# EasyEDA schematic SCH_TWINKLING_CHRISMATIS_LIGHT_2023-04-27.json

## Sheets
1 MAIN_SCHEMATIC_TWINKLING_CHRISTMAS_LIGHT: TITLE: LED twinkling controller microcontroller schematic; REV: 1.0; Date: 2023-02-24; Sheet: 1/1; Drawn By: misha-dig; Company: TWINKLING_CHRISTMAS_LIGHT
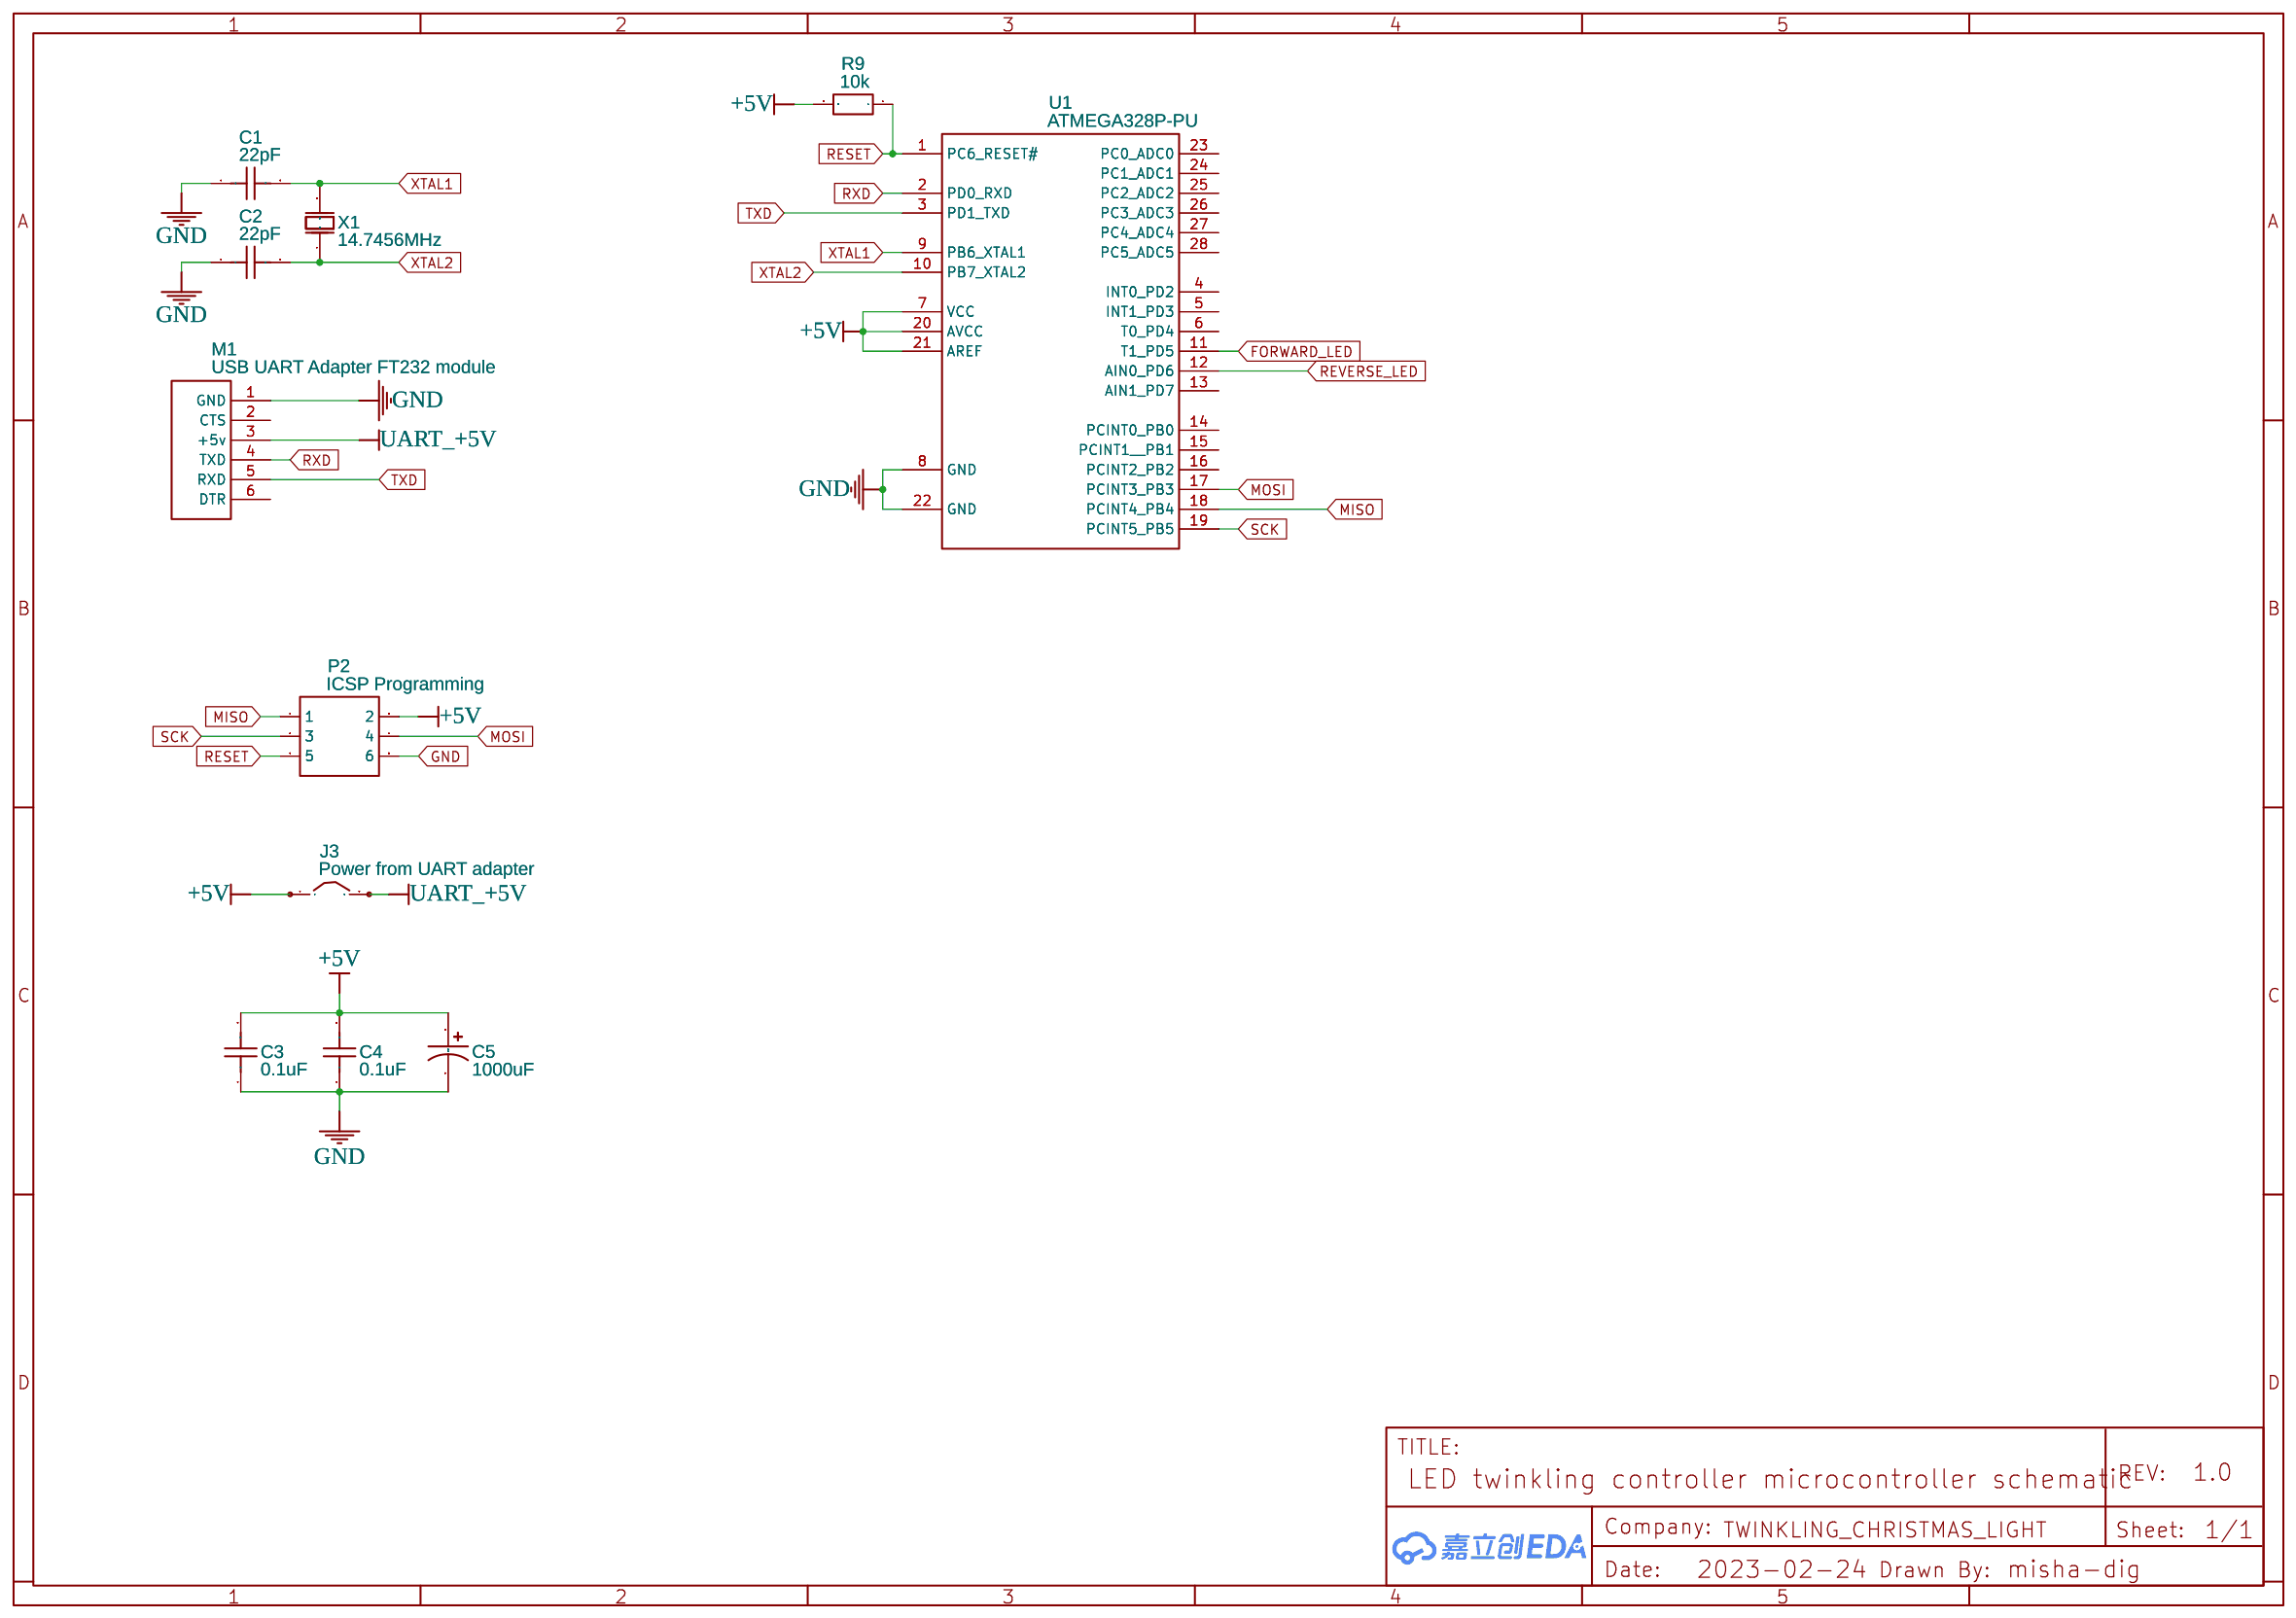
[diagram p0: MAIN_SCHEMATIC_TWINKLING_CHRISTMAS_LIGHT]
2 H-BRIDGE_SCHEMATIC_TWINKLING_CHRISTMAS_LIGHT: TITLE: LED twinkling controller H-Bridge schematic; Date: 2023-04-17
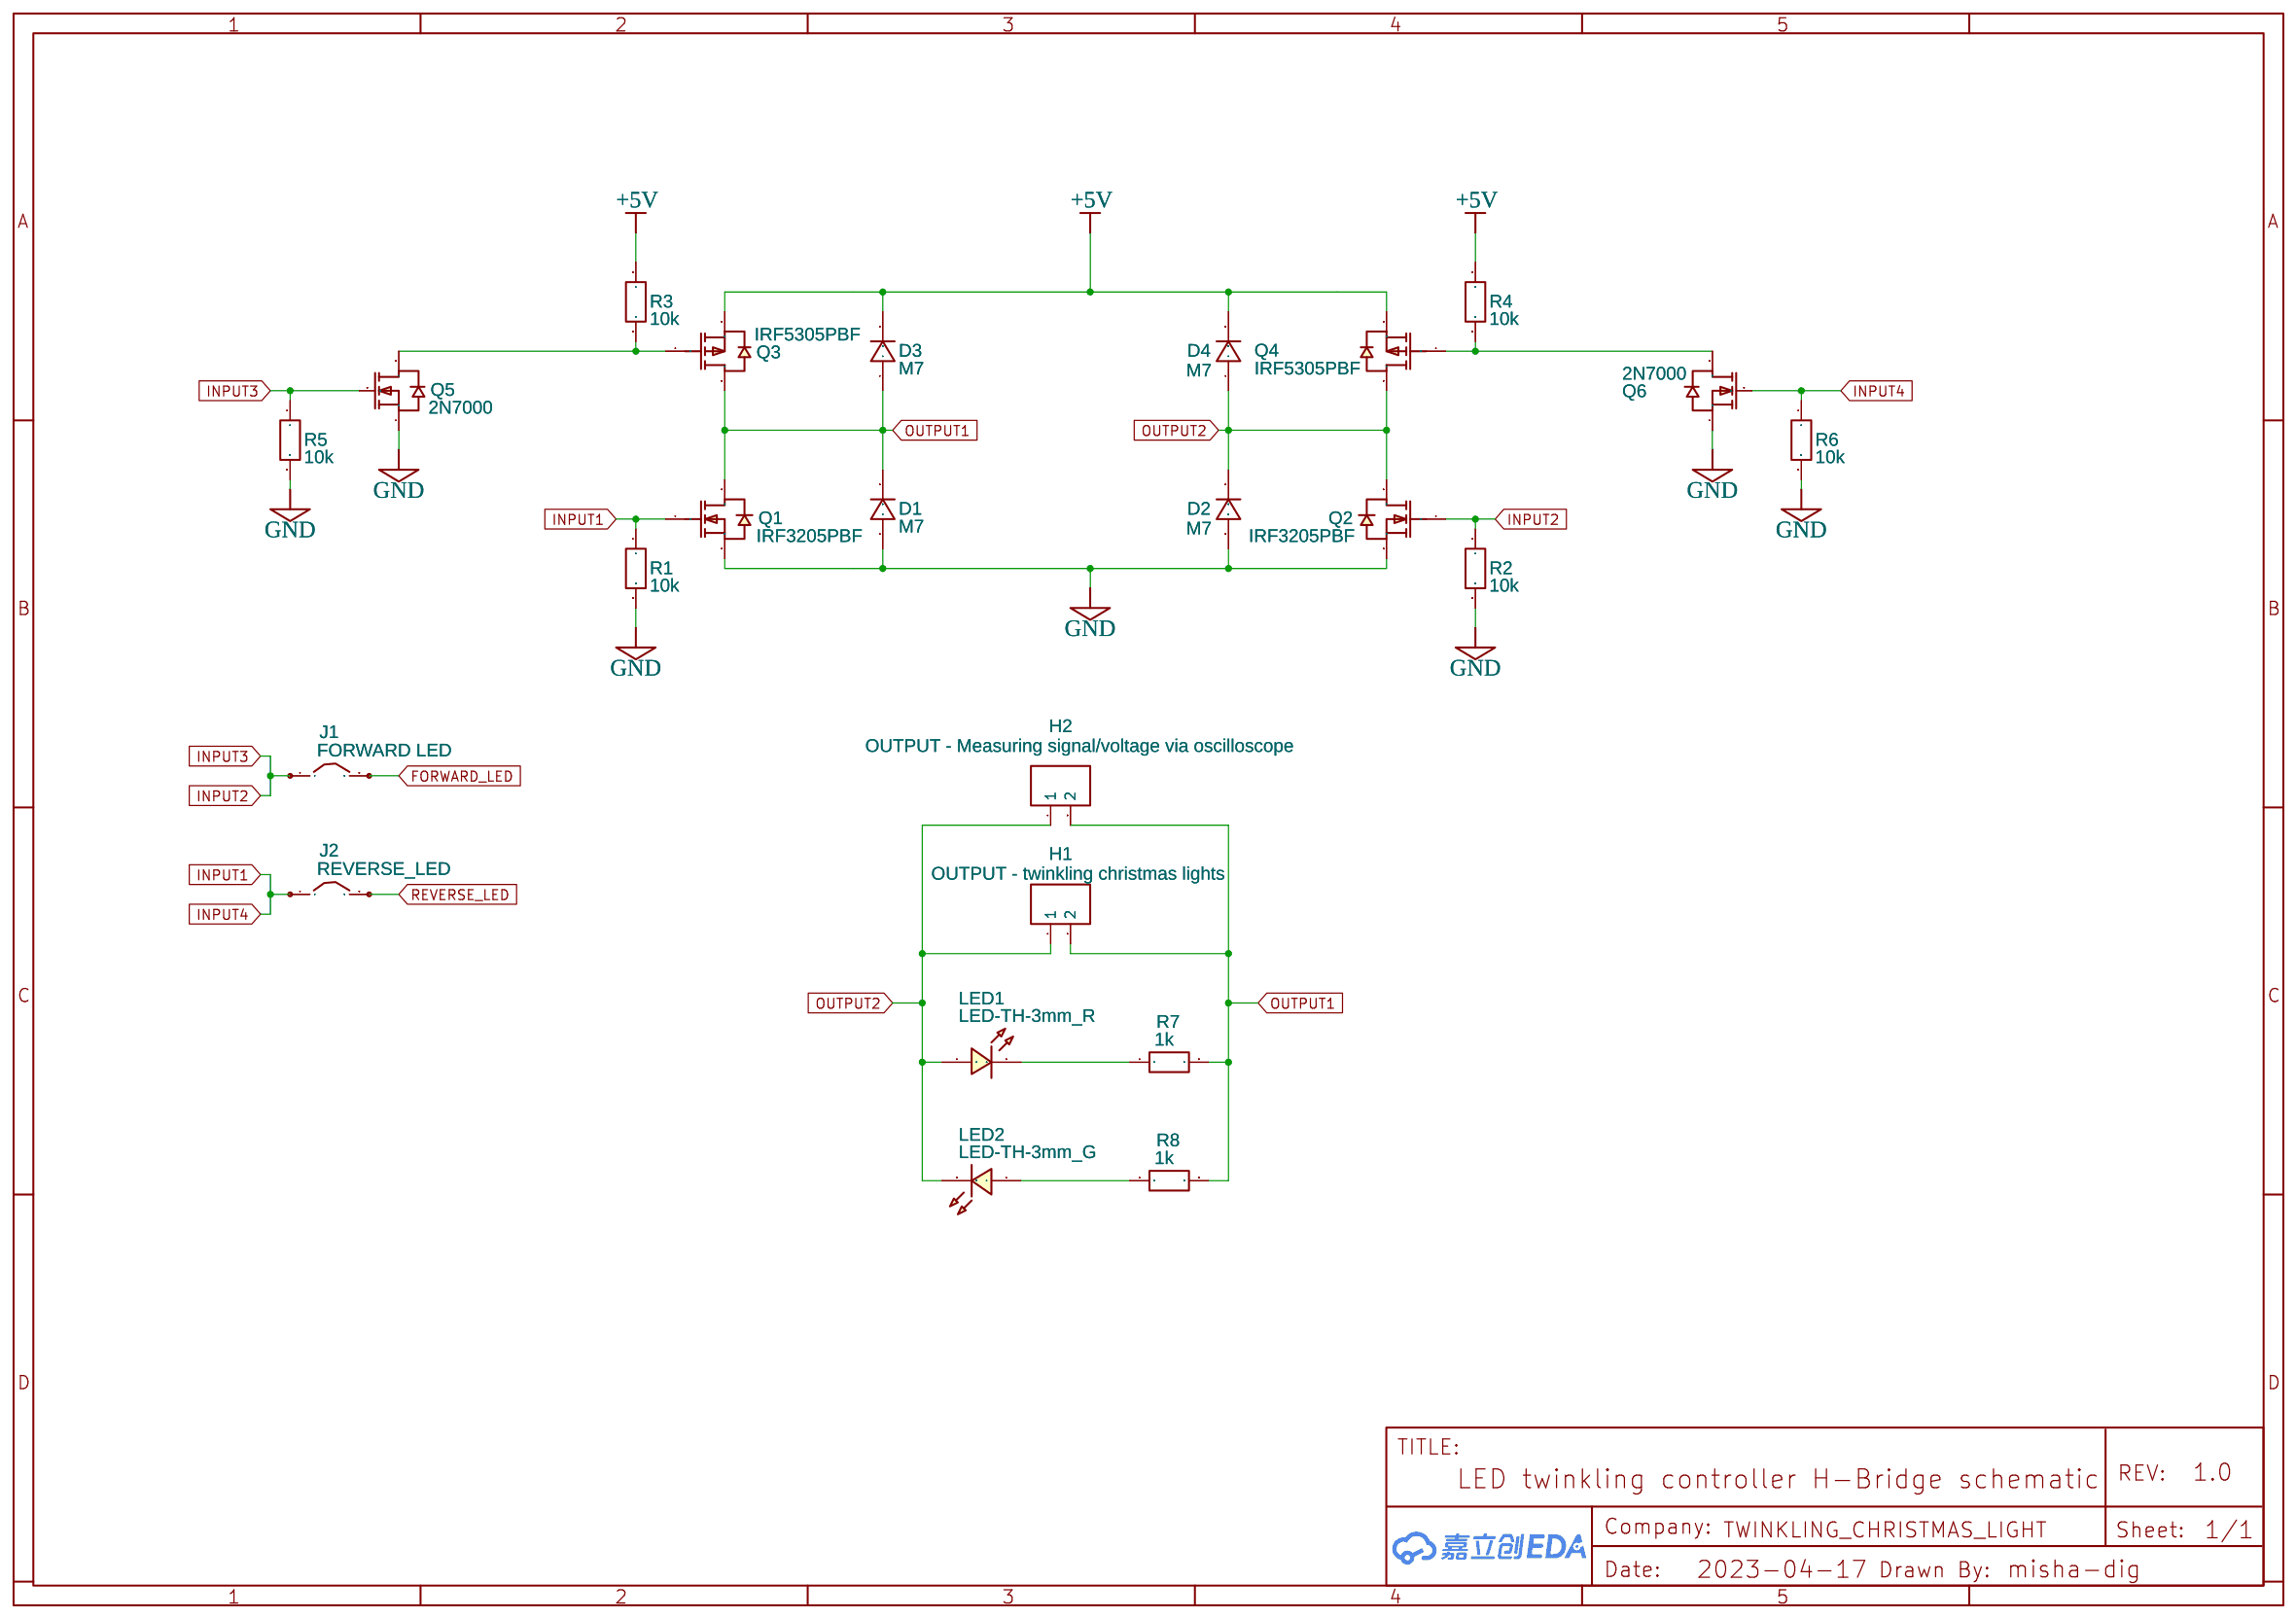
[diagram p1: H-BRIDGE_SCHEMATIC_TWINKLING_CHRISTMAS_LIGHT]

## Parts
sheet H-BRIDGE_SCHEMATIC_TWINKLING_CHRISTMAS_LIGHT
D1  M7  [SMA(DO-214AC)]
D2  M7  [SMA(DO-214AC)]
D3  M7  [SMA(DO-214AC)]
D4  M7  [SMA(DO-214AC)]
H1  OUTPUT - twinkling christmas lights  [HDR-F-2.54_1X2]
H2  OUTPUT - Measuring signal/voltage via oscilloscope  [HDR-F-2.54_1X2]
J1  FORWARD LED  [HDR-TH_2P-P2.54-V-M-1]
J2  REVERSE_LED  [HDR-TH_2P-P2.54-V-M-1]
LED1  LED-TH-3mm_R  [LED-TH_BD3.0_RED]
LED2  LED-TH-3mm_G  [LED-TH_BD3.0_GREEN]
Q1  IRF3205PBF  [TO-220-3_L10.0-W4.5-P2.54-L]
Q2  IRF3205PBF  [TO-220-3_L10.0-W4.5-P2.54-L]
Q3  IRF5305PBF  [TO-220-3_L10.0-W4.5-P2.54-T]
Q4  IRF5305PBF  [TO-220-3_L10.0-W4.5-P2.54-T]
Q5  2N7000  [TO-92-3_L4.9-W3.7-P1.27-L]
Q6  2N7000  [TO-92-3_L4.9-W3.7-P1.27-L]
R1  10k  [R_0805]
R2  10k  [R_0805]
R3  10k  [R_0805]
R4  10k  [R_0805]
R5  10k  [R_0805]
R6  10k  [R_0805]
R7  1k  [R_0805]
R8  1k  [R_0805]
sheet MAIN_SCHEMATIC_TWINKLING_CHRISTMAS_LIGHT
C1  22pF  [C0805]
C2  22pF  [C0805]
C3  0.1uF  [C0805]
C4  0.1uF  [C0805]
C5  1000uF  [CAP-D8.0×F3.5]
J3  Power from UART adapter  [HDR-TH_2P-P2.54-V-M-1]
M1  USB UART Adapter FT232 module  [FT232UART_HEADER]
P2  ICSP Programming  [IDC-TH_6P-P2.54_C11214]
R9  10k  [R0805]
U1  ATMEGA328P-PU  [DIP-28_L34.6-W7.3-P2.54-LS10.2-BL]
X1  14.7456MHz  [HC-49US_L11.5-W4.5-P4.88]

## Library data of the parts
D1-D4 = M7: Supplier: LCSC; Supplier Part: C126233; Manufacturer: SK; Manufacturer Part: 1N4007; Contributor: forexpert
H1 H2 = HDR-F-2.54_1x2: Supplier Part: C49661; Supplier: LCSC; Contributor: LCEDA_Lib
J1-J3 = JUMPERTHRUHOLE: Supplier Part: NONE; Manufacturer: NONE; Manufacturer Part: NONE; Contributor: yang tom
LED1 = LED-TH-3mm_R: Manufacturer: EVERLIGHT(台湾亿光); Manufacturer Part: 204-10SDRD/S530-A3-L; Supplier Part: C84774; Supplier: LCSC; Contributor: LCEDA_Lib
LED2 = LED-TH-3mm_G: Manufacturer: EVERLIGHT(台湾亿光); Manufacturer Part: 204-10SYGD/S530-E3; Supplier Part: C85161; Contributor: LCEDA_Lib
Q1 Q2 = IRF3205PBF: Supplier: LCSC; Manufacturer: Infineon(英飞凌); Supplier Part: C2561; JLCPCB Part Class: Extended Part
Q3 Q4 = IRF5305PBF: Supplier: LCSC; Manufacturer: Infineon(英飞凌); Supplier Part: C2623; JLCPCB Part Class: Extended Part
Q5 Q6 = 2N7000: Supplier: LCSC; Manufacturer: CJ(江苏长电/长晶); Supplier Part: C9114; JLCPCB Part Class: Extended Part
R1-R8 = R_AXIAL-0.6_EU: Contributor: LCEDA_Lib
C1-C4 = C_0805_US: Contributor: LCEDA_Lib
C5 = CE_TH_D8.0×F3.5_US: Contributor: LCEDA_Lib
M1 = FT232UART_HEADER: Contributor: phanegraaf
P2 = HDR-IDC-2.54-2X3P: Supplier: LCSC; Manufacturer: BOOMELE; Manufacturer Part: 2X3 2.54mm IDC Box; image: //image.lceda.cn/szlcsc/C11214.jpg; Supplier Part: C11214
R9 = R_0805_EU: Contributor: LCEDA_Lib
U1 = ATMEGA328P-PU: sourceId: Oic6oiASL; Supplier: LCSC; Manufacturer: MICROCHIP(美国微芯); Contributor: LCSC; Supplier Part: C33901; JLCPCB Part Class: Extended Part
X1 = ECS-147.4-S-1X: Supplier: LCSC; Supplier Part: C2636393; Manufacturer: ECS; link: https://atta.szlcsc.com/upload/public/pdf/source/20210416/102C8839D8A4A50B4DD22241338234A9.pdf; Contributor: lcsc

## Nets
+5V: C3.2 C4.2 C5.1 D3.2 D4.2 J3.1 P2.2 Q3.3(S) Q4.3(S) R3.1 R4.1 R9.2 U1.7(VCC) U1.20(AVCC) U1.21(AREF)
GND: C1.1 C2.1 C3.1 C4.1 C5.2 D1.1 D2.1 M1.1(GND) P2.6 Q1.3(S) Q2.3(S) Q5.1(S) Q6.1(S) R1.2 R2.2 R5.2 R6.2 U1.8(GND) U1.22(GND)
FORWARD_LED: J1.2 U1.11(T1 PD5)
INPUT1: J2.1 Q1.1(G) Q6.2(G) R1.1 R6.1
INPUT2: J1.1 Q2.1(G) Q5.2(G) R2.1 R5.1
MISO: P2.1 U1.18(PCINT4 PB4)
MOSI: P2.4 U1.17(PCINT3 PB3)
OUTPUT1: D1.2 D3.1 H1.2 H2.2 Q1.2(D) Q3.2(D) R7.2 R8.2
OUTPUT2: D2.2 D4.1 H1.1 H2.1 LED1.1 LED2.2 Q2.2(D) Q4.2(D)
RESET: P2.5 R9.1 U1.1(PC6 RESET#)
REVERSE_LED: J2.2 U1.12(AIN0 PD6)
RXD: M1.4(TXD) U1.2(PD0 RXD)
SCK: P2.3 U1.19(PCINT5 PB5)
TXD: M1.5(RXD) U1.3(PD1 TXD)
UART_+5V: J3.2 M1.3(+5v)
XTAL1: C1.2 U1.9(PB6 XTAL1) X1.2(OSC2)
XTAL2: C2.2 U1.10(PB7 XTAL2) X1.1(OSC1)
Net-(LED1-2): LED1.2 R7.1
Net-(LED2-1): LED2.1 R8.1
Net-(Q3-1): Q3.1(G) Q5.3(D) R3.2
Net-(Q4-1): Q4.1(G) Q6.3(D) R4.2

Not connected (* = marked no-connect by the designer): M1 2(CTS) 6(DTR); U1 4(INT0 PD2) 5(INT1 PD3) 6(T0 PD4) 13(AIN1 PD7) 14(PCINT0 PB0) 15(PCINT1  PB1) 16(PCINT2 PB2) 23(PC0 ADC0) 24(PC1 ADC1) 25(PC2 ADC2) 26(PC3 ADC3) 27(PC4 ADC4) 28(PC5 ADC5)
